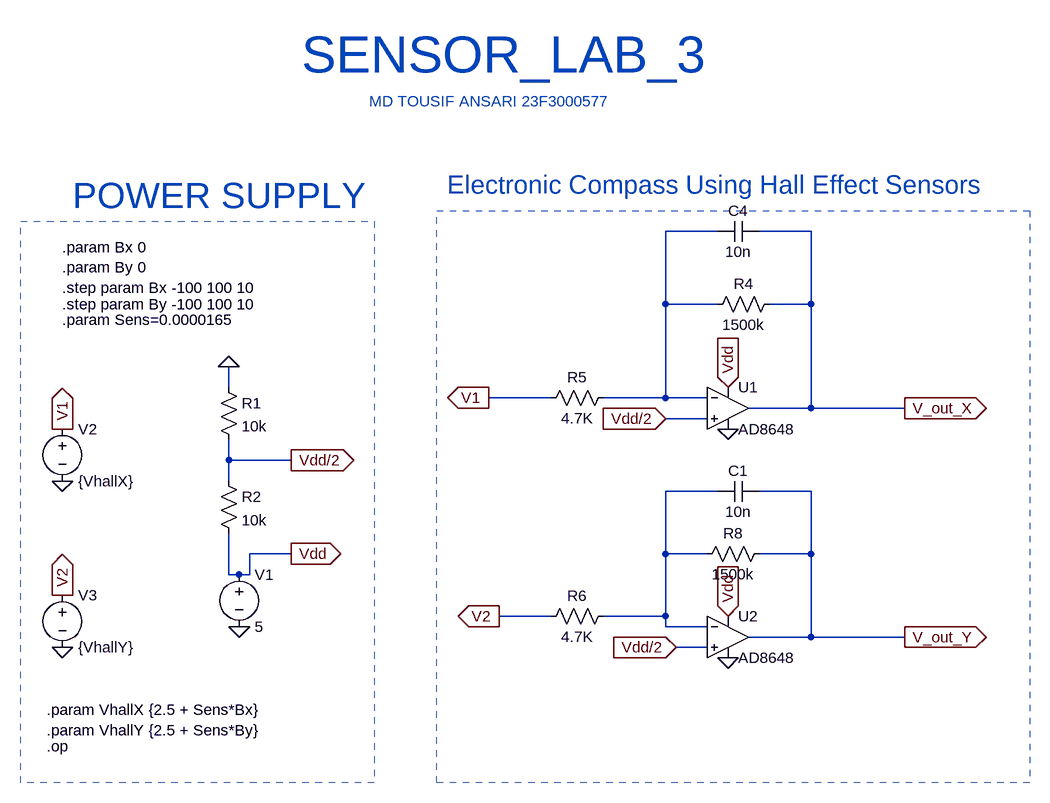
[diagram p0: schematic ELECTRONIC_CAMPUS.asc]
ELECTRONIC_CAMPUS.asc, the LTspice schematic file:
Version 4.1
SHEET 1 880 680
WIRE -448 -816 -528 -816
WIRE -304 -816 -384 -816
WIRE -528 -704 -528 -816
WIRE -448 -704 -528 -704
WIRE -304 -704 -304 -816
WIRE -304 -704 -368 -704
WIRE -1200 -576 -1200 -608
WIRE -704 -560 -800 -560
WIRE -528 -560 -528 -704
WIRE -528 -560 -624 -560
WIRE -464 -560 -528 -560
WIRE -304 -544 -304 -704
WIRE -304 -544 -400 -544
WIRE -160 -544 -304 -544
WIRE -464 -528 -528 -528
WIRE -1200 -464 -1200 -496
WIRE -1104 -464 -1200 -464
WIRE -1200 -432 -1200 -464
WIRE -448 -416 -528 -416
WIRE -304 -416 -384 -416
WIRE -1104 -320 -1168 -320
WIRE -528 -320 -528 -416
WIRE -464 -320 -528 -320
WIRE -304 -320 -304 -416
WIRE -304 -320 -384 -320
WIRE -1200 -288 -1200 -352
WIRE -1184 -288 -1200 -288
WIRE -1168 -288 -1168 -320
WIRE -1168 -288 -1184 -288
WIRE -704 -224 -784 -224
WIRE -528 -224 -528 -320
WIRE -528 -224 -624 -224
WIRE -528 -208 -528 -224
WIRE -464 -208 -528 -208
WIRE -304 -192 -304 -320
WIRE -304 -192 -400 -192
WIRE -160 -192 -304 -192
WIRE -464 -176 -512 -176
FLAG -1184 -208 0
FLAG -1200 -608 0
FLAG -1104 -320 Vdd
IOPIN -1104 -320 Out
FLAG -1104 -464 Vdd/2
IOPIN -1104 -464 Out
FLAG -432 -512 0
FLAG -432 -160 0
FLAG -432 -576 Vdd
IOPIN -432 -576 In
FLAG -432 -224 Vdd
IOPIN -432 -224 In
FLAG -1456 -176 0
FLAG -1456 -432 0
FLAG -1456 -512 V1
IOPIN -1456 -512 Out
FLAG -1456 -256 V2
IOPIN -1456 -256 Out
FLAG -800 -560 V1
IOPIN -800 -560 Out
FLAG -784 -224 V2
IOPIN -784 -224 Out
FLAG -528 -528 Vdd/2
IOPIN -528 -528 In
FLAG -512 -176 Vdd/2
IOPIN -512 -176 In
FLAG -160 -544 V_out_X
IOPIN -160 -544 Out
FLAG -160 -192 V_out_Y
IOPIN -160 -192 Out
SYMBOL voltage -1184 -304 R0
SYMATTR InstName V1
SYMATTR Value 5
SYMBOL res -1216 -592 R0
SYMATTR InstName R1
SYMATTR Value 10k
SYMBOL res -1216 -448 R0
SYMATTR InstName R2
SYMATTR Value 10k
SYMBOL OpAmps\\AD8648 -432 -608 R0
SYMATTR InstName U1
SYMBOL OpAmps\\AD8648 -432 -256 R0
SYMATTR InstName U2
SYMBOL res -352 -720 R90
WINDOW 0 0 56 VBottom 2
WINDOW 3 32 56 VTop 2
SYMATTR InstName R4
SYMATTR Value 1500k
SYMBOL res -608 -576 R90
WINDOW 0 0 56 VBottom 2
WINDOW 3 32 56 VTop 2
SYMATTR InstName R5
SYMATTR Value 4.7K
SYMBOL res -608 -240 R90
WINDOW 0 0 56 VBottom 2
WINDOW 3 32 56 VTop 2
SYMATTR InstName R6
SYMATTR Value 4.7K
SYMBOL res -368 -336 R90
WINDOW 0 0 56 VBottom 2
WINDOW 3 32 56 VTop 2
SYMATTR InstName R8
SYMATTR Value 1500k
SYMBOL cap -384 -432 R90
WINDOW 0 0 32 VBottom 2
WINDOW 3 32 32 VTop 2
SYMATTR InstName C1
SYMATTR Value 10n
SYMBOL cap -384 -832 R90
WINDOW 0 0 32 VBottom 2
WINDOW 3 32 32 VTop 2
SYMATTR InstName C4
SYMATTR Value 10n
SYMBOL voltage -1456 -528 R0
SYMATTR InstName V2
SYMATTR Value {VhallX}
SYMBOL voltage -1456 -272 R0
SYMATTR InstName V3
SYMATTR Value {VhallY}
TEXT -1480 -24 Left 2 !.op
TEXT -1456 -680 Left 2 !.param Sens=0.0000165
TEXT -1480 -80 Left 2 !.param VhallX {2.5 + Sens*Bx}\n.param VhallY {2.5 + Sens*By}
TEXT -1456 -792 Left 2 !.param Bx 0\n.param By 0\n.step param Bx -100 100 10
TEXT -1456 -704 Left 2 !.step param By -100 100 10
TEXT -1088 -1088 Left 6 ;SENSOR_LAB_3
TEXT -1440 -872 Left 5 ;POWER SUPPLY
TEXT -864 -888 Left 4 ;Electronic Compass Using Hall Effect Sensors
TEXT -984 -1016 Left 2 ;MD TOUSIF ANSARI 23F3000577
RECTANGLE Normal -976 32 -1520 -832 2
RECTANGLE Normal 32 32 -880 -848 1

The netlist it stands for:
* ELECTRONIC_CAMPUS.asc
V1 Vdd 0 5
R1 0 Vdd/2 10k
R2 Vdd/2 Vdd 10k
X§U1 Vdd/2 N001 Vdd 0 V_out_X AD8648  ; pins In+ In- V+ V- OUT
X§U2 Vdd/2 N002 Vdd 0 V_out_Y AD8648  ; pins In+ In- V+ V- OUT
R4 V_out_X N001 1500k
R5 N001 V1 4.7K
R6 N002 V2 4.7K
R8 V_out_Y N002 1500k
C1 V_out_Y N002 10n
C4 V_out_X N001 10n
V2 V1 0 {VhallX}
V3 V2 0 {VhallY}
.op
.param Sens=0.0000165
.param VhallX {2.5 + Sens*Bx}
.param VhallY {2.5 + Sens*By}
.param Bx 0
.param By 0
.step param Bx -100 100 10
.step param By -100 100 10
* SENSOR_LAB_3
* POWER SUPPLY
* Electronic Compass Using Hall Effect Sensors
* MD TOUSIF ANSARI 23F3000577
.lib ADI.lib
.backanno
.end